# EAGLE schematic main (EAGLE 6.4)
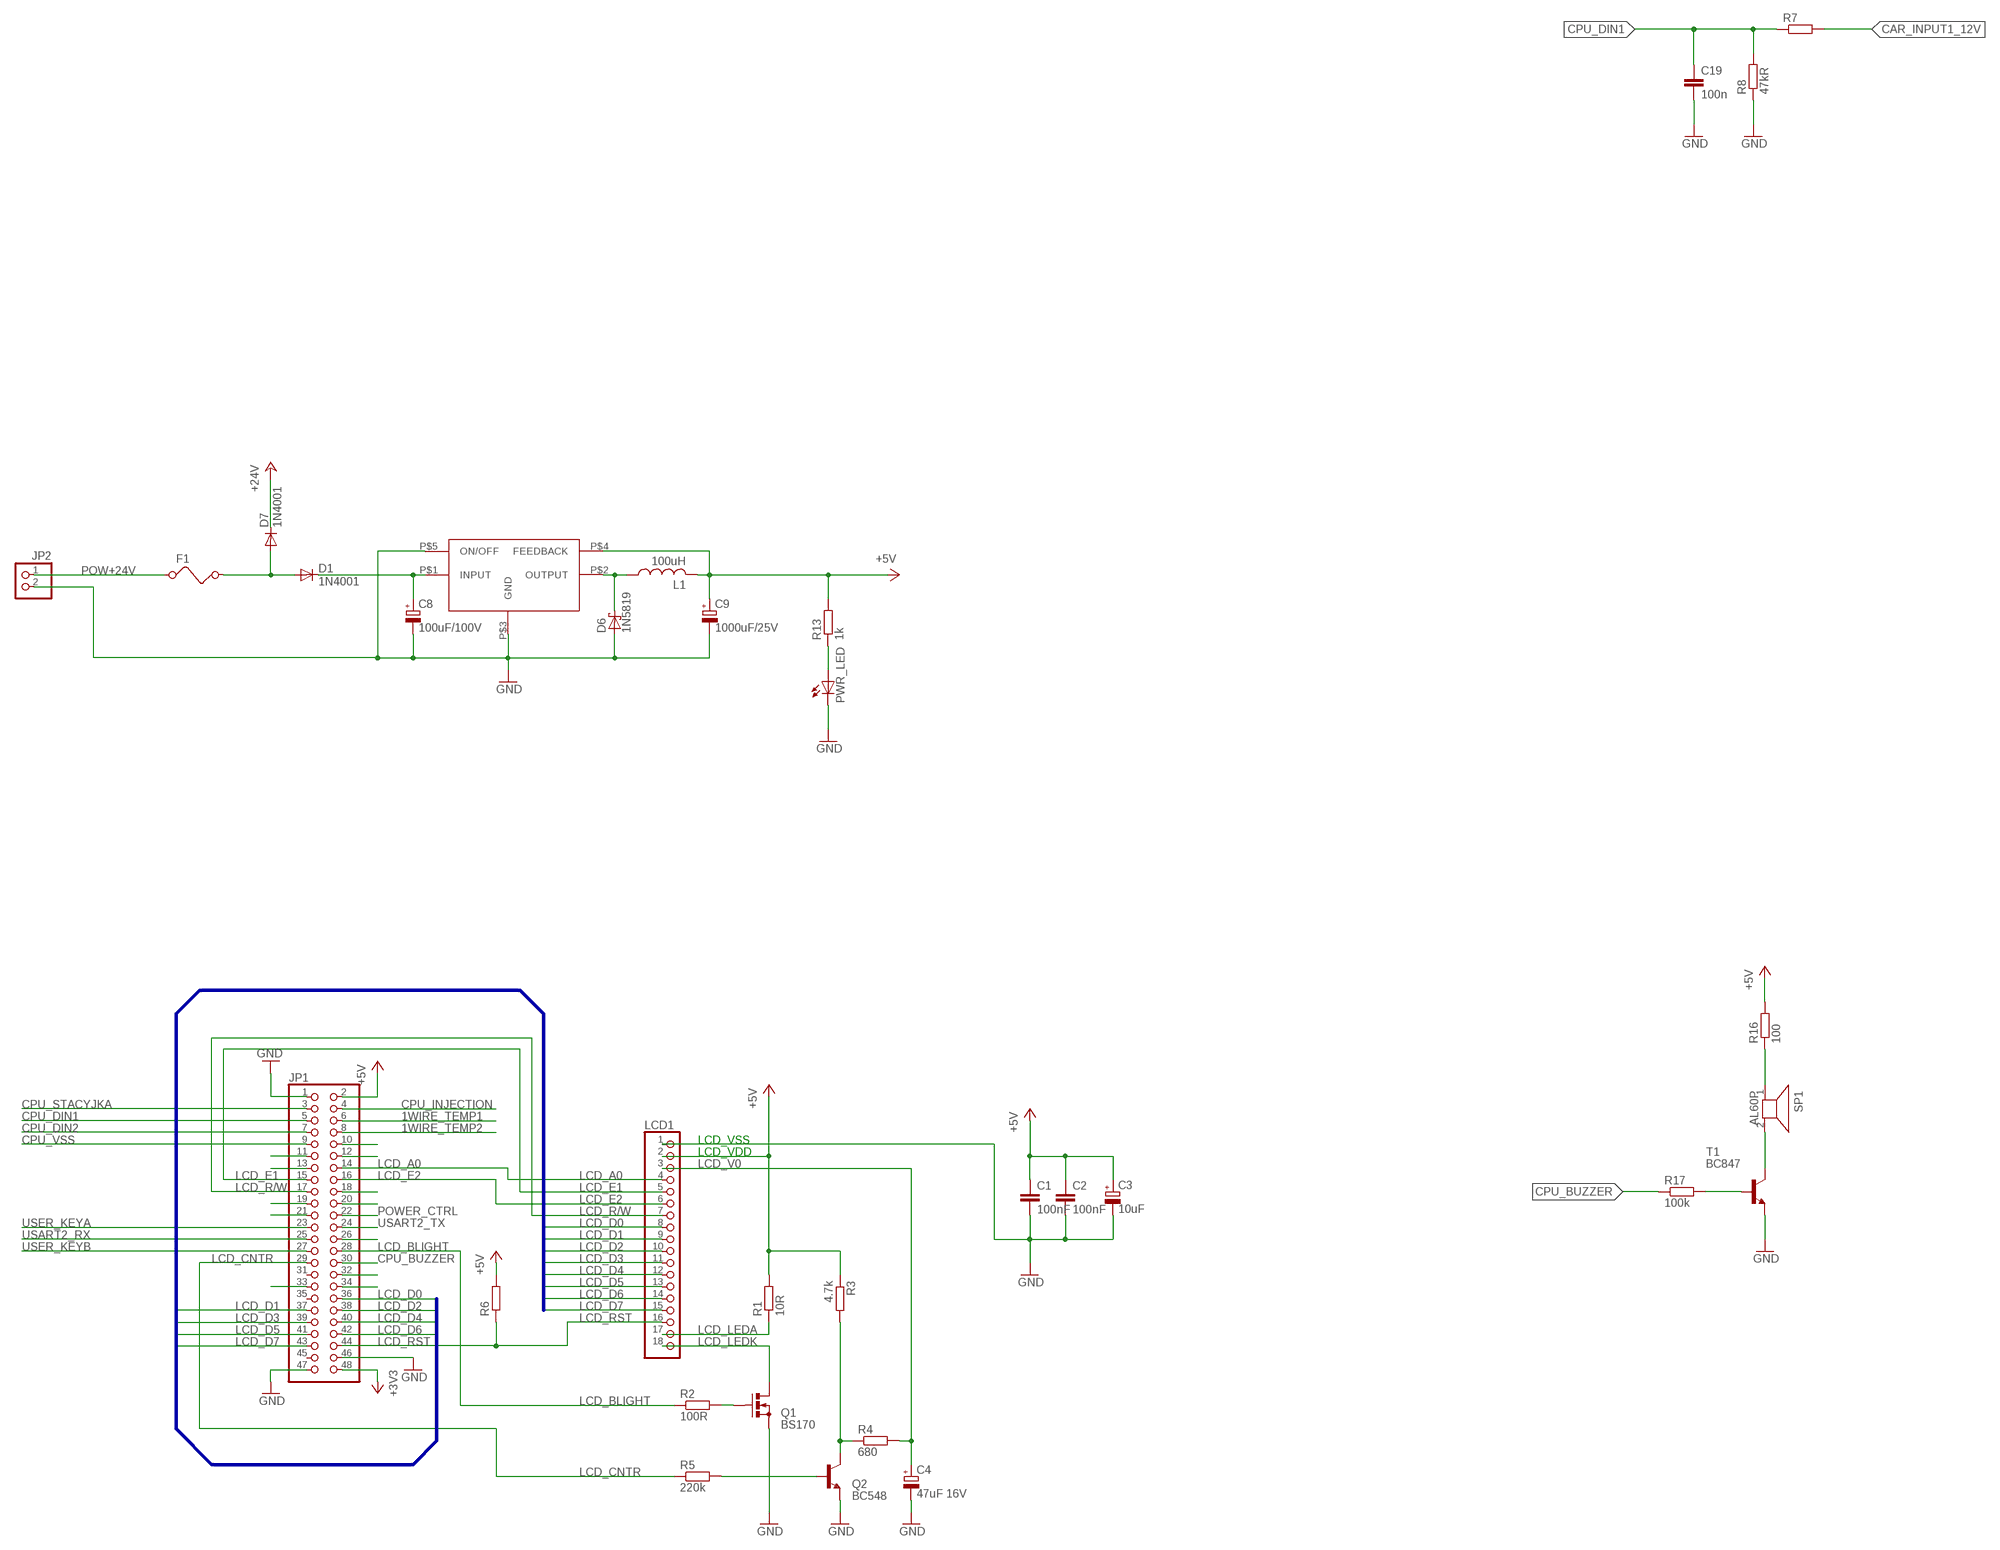
[diagram p0: schematic, sheet 1, part 1 of 2]
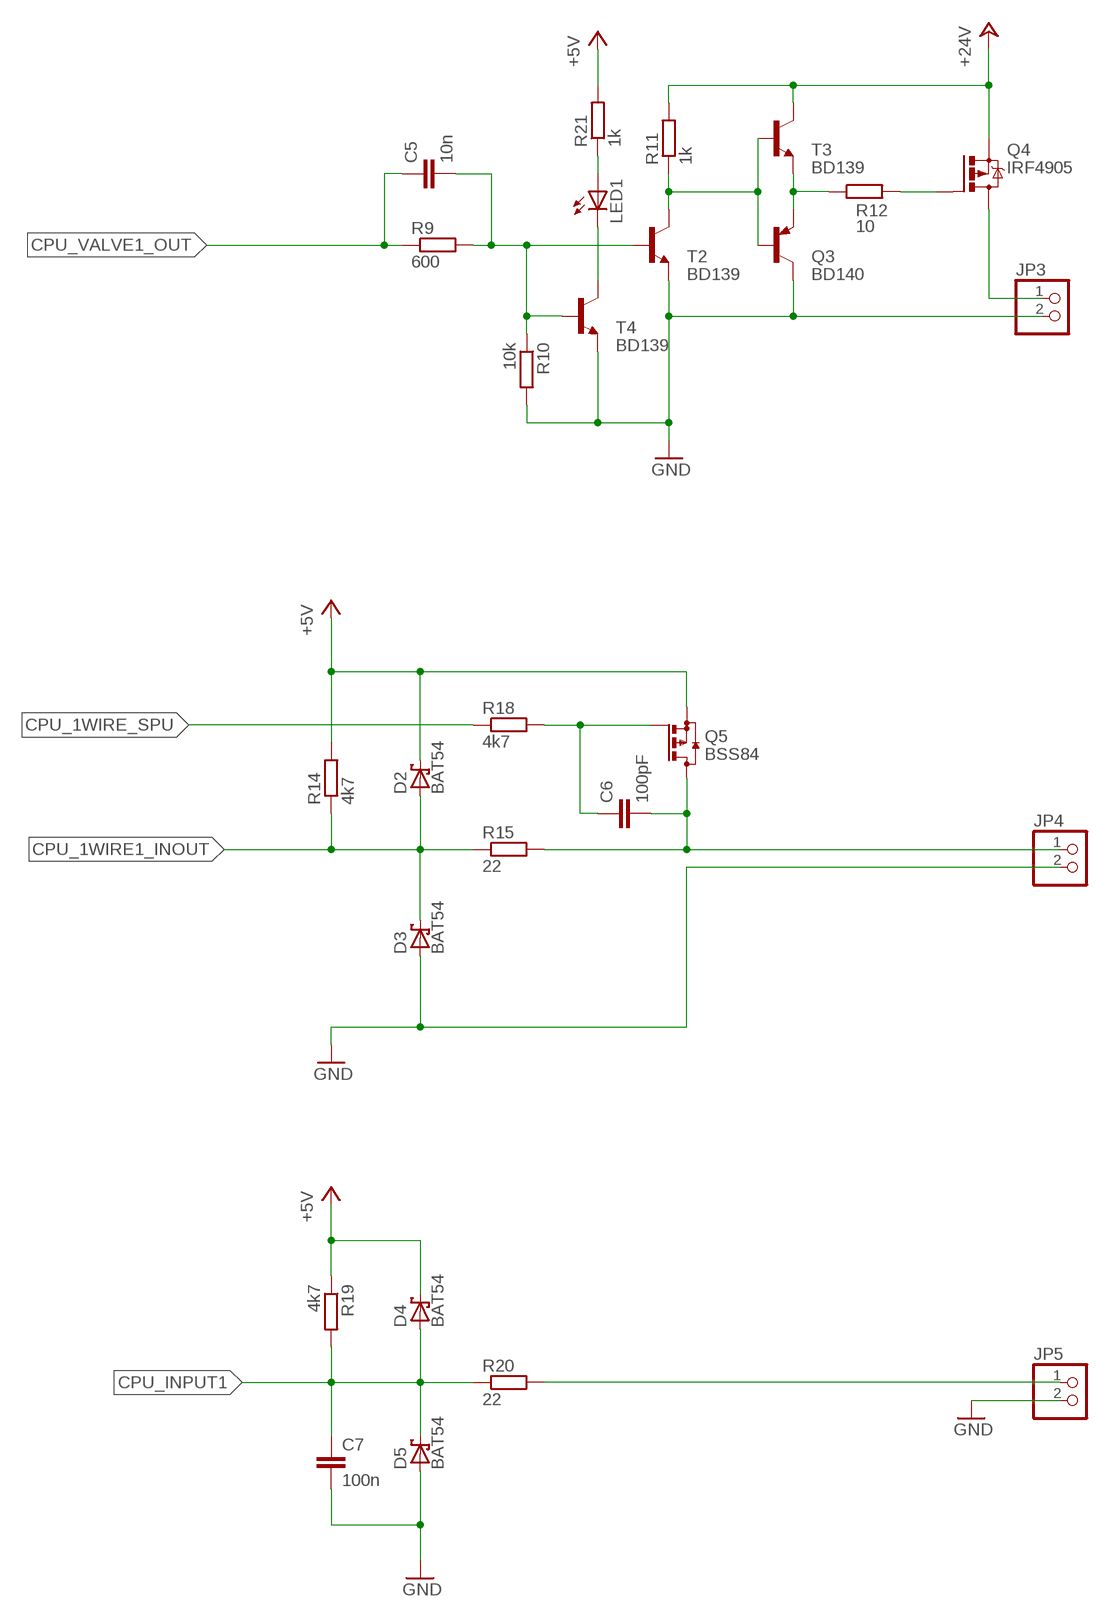
[diagram p1: schematic, sheet 1, part 2 of 2]

## Parts
C1  100nF  C-EU025-024X044  [C025-024X044]
C2  100nF  C-EU025-024X044  [C025-024X044]
C3  10uF  CPOL-EU085CS-1AR  [085CS_1AR]
C4  47uF 16V  CPOL-EU085CS-1AR  [085CS_1AR]
C5  10n  C-EU025-024X044  [C025-024X044]
C6  100pF  C-EU025-024X044  [C025-024X044]
C7  100n  C-EU025-024X044  [C025-024X044]
C8  100uF/100V  CPOL-EUE1.8-4  [E1,8-4]
C9  1000uF/25V  CPOL-EUE1.8-4  [E1,8-4]
C19  100n  C-EU025-024X044  [C025-024X044]
D1  1N4001  1N4004  [DO41-10]
D2  BAT54  [SOT23]
D3  BAT54  [SOT23]
D4  BAT54  [SOT23]
D5  BAT54  [SOT23]
D6  1N5819  BAS40  [SOT23]
D7  1N4001  1N4004  [DO41-10]
F1  FUSE  [FUSE]
IC1  LM2575  [TO-220]
JP1  PINHD-2X24  [2X24]
JP2  PINHD-1X2  [1X02]
JP3  PINHD-1X2  [1X02]
JP4  PINHD-1X2  [1X02]
JP5  PINHD-1X2  [1X02]
L1  100uH  L-US0204/5  [0204/5]
LCD1  PINHD-1X18  [1X18]
LED1  LED  [SMARTLED-TTW]
PWR_LED  LED  [SMARTLED-TTW]
Q1  BS170  [SOT54E]
Q2  BC548  [TO92-EBC]
Q3  BD140  [TO126]
Q4  IRF4905  [TO220BH]
Q5  BSS84  [SOT23]
R1  10R  R-EU_0204/2V  [0204V]
R2  100R  R-EU_0204/2V  [0204V]
R3  4.7k  R-EU_0204/2V  [0204V]
R4  680  R-EU_0204/2V  [0204V]
R5  220k  R-EU_0204/2V  [0204V]
R6  R-EU_0204/2V  [0204V]
R7  R-EU_0204/2V  [0204V]
R8  47kR  R-EU_0204/2V  [0204V]
R9  600  R-EU_0204/2V  [0204V]
R10  10k  R-EU_0204/2V  [0204V]
R11  1k  R-EU_0204/2V  [0204V]
R12  10  R-EU_0204/2V  [0204V]
R13  1k  R-EU_0204/2V  [0204V]
R14  4k7  R-EU_0204/2V  [0204V]
R15  22  R-EU_0204/2V  [0204V]
R16  100  R-EU_0204/2V  [0204V]
R17  100k  R-EU_0204/2V  [0204V]
R18  4k7  R-EU_0204/2V  [0204V]
R19  4k7  R-EU_0204/2V  [0204V]
R20  22  R-EU_0204/2V  [0204V]
R21  1k  R-EU_0204/2V  [0204V]
SP1  AL60P  [AL60P]
T1  BC847  [SOT23]
T2  BD139  [TO126]
T3  BD139  [TO126]
T4  BD139  [TO126]

## Nets
1WIRE_TEMP1: JP1.6
1WIRE_TEMP2: JP1.8
+3V3: JP1.48
+5V: C1.1 C2.1 C3.+ C9.+ D2.3(C) D4.3(C) IC1.P$4(FEEDBACK) JP1.2 L1.2 LCD1.2 Q5.2(S) R1.2 R3.1 R6.2 R13.2 R14.2 R16.2 R19.1 R21.2
+24V: D7.C Q4.S R11.2 T3.2(C)
?: C6.2 JP4.1 Q5.3(D) R15.2
CAR_INPUT1_12V: R7.2
CPU_1WIRE1_INOUT: D2.1(A) D3.3(C) R14.1 R15.1
CPU_1WIRE_SPU: R18.1
CPU_BUZZER: JP1.30 R17.1
CPU_DIN1: C19.1 JP1.5 R7.1 R8.2
CPU_DIN2: JP1.7
CPU_INJECTION: JP1.4
CPU_INPUT1: C7.1 D4.1(A) D5.3(C) R19.2 R20.1
CPU_STACYJKA: JP1.3
CPU_VALVE1_OUT: C5.1 R9.1
CPU_VSS: JP1.9
GND: C1.2 C2.2 C3.- C4.- C7.2 C8.- C9.- C19.2 D3.1(A) D5.1(A) D6.1(A) IC1.P$3(GND) IC1.P$5(ON/OFF) JP1.1 JP1.46 JP1.47 JP2.2 JP4.2 JP5.2 LCD1.1 PWR_LED.C@1(C) Q1.S Q2.E Q3.2(C) R8.1 R10.2 T1.2(E) T2.1(E) T4.1(E)
LCD_A0: JP1.14 LCD1.4
LCD_BLIGHT: JP1.28 R2.1
LCD_CNTR: JP1.29 R5.1
LCD_D0: JP1.36 LCD1.8
LCD_D1: JP1.37 LCD1.9
LCD_D2: JP1.38 LCD1.10
LCD_D3: JP1.39 LCD1.11
LCD_D4: JP1.40 LCD1.12
LCD_D5: JP1.41 LCD1.13
LCD_D6: JP1.42 LCD1.14
LCD_D7: JP1.43 LCD1.15
LCD_E1: JP1.15 LCD1.5
LCD_E2: JP1.16 LCD1.6
LCD_LEDA: LCD1.17 R1.1
LCD_LEDK: LCD1.18 Q1.D
LCD_R/W: JP1.17 LCD1.7
LCD_RST: JP1.44 LCD1.16 R6.1
LCD_V0: C4.+ LCD1.3 R4.2
N$1: Q2.C R3.2 R4.1
N$2: Q1.G R2.2
N$3: Q2.B R5.2
N$4: C5.2 R9.2 R10.1 T2.3(B) T4.3(B)
N$6: Q3.3(B) R11.1 T2.2(C) T3.3(B)
N$7: Q4.G R12.2
N$8: Q3.1(E) R12.1 T3.1(E)
N$9: JP5.1 R20.2
N$10: JP3.1 Q4.D
N$11: LED1.A@1(A) R21.1
N$12: C6.1 Q5.1(G) R18.2
N$13: JP3.2
N$14: LED1.C@1(C) T4.2(C)
N$16: D1.A D7.A F1.2
N$17: SP1.2 T1.3(C)
N$18: C8.+ D1.C IC1.P$1(INPUT)
N$20: D6.3(C) IC1.P$2(OUTPUT) L1.1
N$22: PWR_LED.A@1(A) R13.1
N$24: R16.1 SP1.1
N$25: JP1.10
N$26: R17.2 T1.1(B)
N$27: JP1.12
N$28: JP1.11
N$29: JP1.13
N$30: JP1.19
N$31: JP1.21
N$32: JP1.18
N$33: JP1.20
N$34: JP1.34
N$35: JP1.32
N$36: JP1.33
N$37: JP1.26
POW+24V: F1.1 JP2.1
POWER_CTRL: JP1.22
USART2_RX: JP1.25
USART2_TX: JP1.24
USER_KEYA: JP1.23
USER_KEYB: JP1.27
Unconnected: JP1.31 JP1.35 JP1.45

## Buses
B$1

## Notes on the sheet
- LCD_VSS
- LCD_VDD

## Library data of the parts
C1 C2 C5-C7 C19 = rcl:C-EU: CAPACITOR, European symbol
C3 C4 C8 C9 = rcl:CPOL-EU: POLARIZED CAPACITOR, European symbol
D1 D7 = diode:1N4004: DIODE general purpose rectifier, 1 A
D2-D5 = diode:BAT54: Schottky Diodes Source: Fairchild .. BAT54.pdf
D6 = diode:BAS40: Silicon Schottky Diodes General-purpose diode for high-speed switching
F1 = special:FUSE: FUSE 5 x 20 mm
IC1 = eagle:LM2575
JP1 = pinhead:PINHD-2X24: PIN HEADER
JP2-JP5 = pinhead:PINHD-1X2: PIN HEADER
L1 = rcl:L-US: INDUCTOR, American symbol
LCD1 = pinhead:PINHD-1X18: PIN HEADER
LED1 PWR_LED = led:LED: LED OSRAM: - CHIPLED LG R971, LG N971, LY N971, LG Q971, LY Q971, LO R971, LY R971 LH N974, LH R974 LS Q976, LO Q976, LY Q976 LO Q996 - Hyper CHIPLED LW Q18S LB Q993, LB Q99A, LB R99A - SideLED LS A670, LO A670, LY A670, LG A670, LP A670 LB A673, LV A673, LT A673, LW A673 LH A674 LY A675 LS A676, LA A676, LO A676, LY A676, LW A676 LS A679, LY A679, LG A679 - Hyper Micro SIDELED® LS Y876, LA Y876, LO Y876, LY Y876 LT Y87S - SmartLED LW L88C, LW L88S LB L89C, LB L89S, LG L890 LS L89K, LO L89K, LY L89K LS L896, LA L896, LO L896, LY L896 - TOPLED LS T670, LO T670, LY T670, LG T670, LP T670 LSG T670, LSP T670, LSY T670, LOP T670, LYG T670 LG T671, LOG T671, LSG T671 LB T673, LV T673, LT T673, LW T673 LH T674 LS T676, LA T676, LO T676, LY T676, LB T676, LH T676, LSB T676, LW T676 LB T67C, LV T67C, LT T67C, LS T67K, LO T67K, LY T67K, LW E67C LS E67B, LA E67B, LO E67B, LY E67B, LB E67C, LV E67C, LT E67C LW T67C LS T679, LY T679, LG T679 LS T770, LO T770, LY T770, LG T770, LP T770 LB T773, LV T773, LT T773, LW T773 LH T774 LS E675, LA E675, LY E675, LS T675 LS T776, LA T776, LO T776, LY T776, LB T776 LHGB T686 LT T68C, LB T68C - Hyper Mini TOPLED® LB M676 - Mini TOPLED Santana® LG M470 LS M47K, LO M47K, LY M47K Source: http://www.osram.convergy.de LUXEON: - LUMILED® LXK2-PW12-R00, LXK2-PW12-S00, LXK2-PW14-U00, LXK2-PW14-V00 LXK2-PM12-R00, LXK2-PM12-S00, LXK2-PM14-U00 LXK2-PE12-Q00, LXK2-PE12-R00, LXK2-PE12-S00, LXK2-PE14-T00, LXK2-PE14-U00 LXK2-PB12-K00, LXK2-PB12-L00, LXK2-PB12-M00, LXK2-PB14-N00, LXK2-PB14-P00, LXK2-PB14-Q00 LXK2-PR12-L00, LXK2-PR12-M00, LXK2-PR14-Q00, LXK2-PR14-R00 LXK2-PD12-Q00, LXK2-PD12-R00, LXK2-PD12-S00 LXK2-PH12-R00, LXK2-PH12-S00 LXK2-PL12-P00, LXK2-PL12-Q00, LXK2-PL12-R00 Source: www.luxeon.com KINGBRIGHT: KA-3528ASYC Source: www.kingbright.com
Q1 = transistor-small-signal:BS170: N-CHANNEL MOS FET
Q2 = transistor-npn:BC548*: NPN Transistor
Q3 = transistor-pnp:BD140: PNP Transistor
Q4 = transistor-power:IRF4905: P-Channel HEXFET® Power MOSFET RDS(on)= 0.02 Ohm, ID = -74A Source: http://www.irf.com/product-info/datasheets/data/irf4905pbf.pdf
Q5 = transistor-small-signal:BSS84: P-CHANNEL MOS FET
R1-R21 = rcl:R-EU_: RESISTOR, European symbol
SP1 = buzzer:AL60P: SPEAKER Source: Buerklin; OC_FARNELL: unknown; OC_NEWARK: unknown
T1 = transistor:BC847: NPN TRANSISTOR
T2-T4 = transistor:BD139: NPN TRANSISTOR